# EAGLE schematic TestBoard (EAGLE 9.6.2)
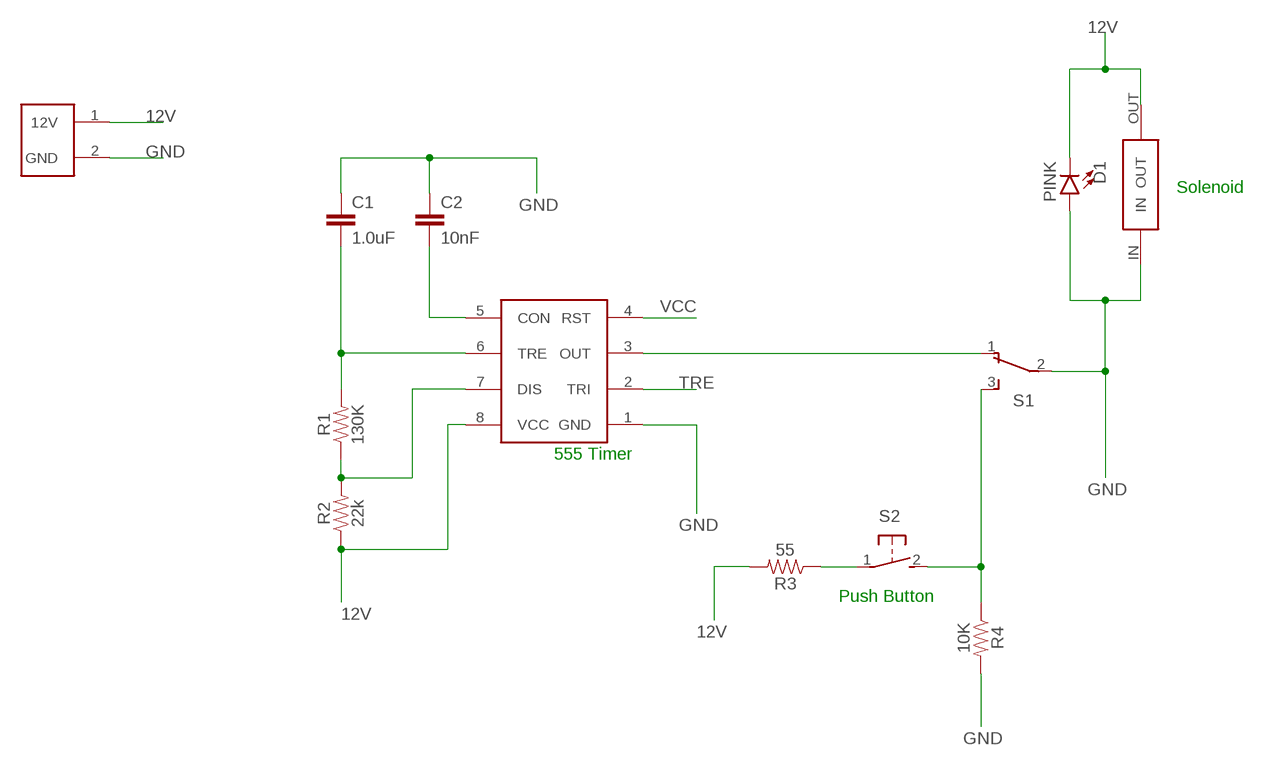
[diagram p0: schematic, sheet 1]

## Parts
C1  1.0uF  1.0UF-0402-16V-10%  [0402]
C2  10nF  10NF-0603-50V-10%  [0603]
D1  PINK  LED-PINK1206  [LED-1206]
R1  130K  0.22OHM-0805-1/4W-1%  [0805]
R2  22k  0.22OHM-0805-1/4W-1%  [0805]
R3  55  0.22OHM-0805-1/4W-1%  [0805]
R4  10K  0.22OHM-0805-1/4W-1%  [0805]
S1  TL36YO  [TL3XYO]
S2  31-XX  [B3F-31XX]
U$1  555TIMER  [555TIME]
U$2  BARRELJACK  [BARRELJACK]
U$3  SOLENOID  [SOL]

## Nets
12V: D1.C R2.1 R3.2 U$1.8(VCC) U$2.1(12V) U$3.OUT
GND: C1.1 C2.1 D1.A R4.2 S1.2(P) U$1.1(GND) U$2.2(GND) U$3.IN
N$1: R3.1 S2.1(P)
N$2: S1.1(O) U$1.3(OUT)
N$3: C1.2 R1.2 U$1.6(TRE)
N$4: C2.2 U$1.5(CON)
N$5: R4.1 S1.3(S) S2.2(S)
N$8: R1.1 R2.2 U$1.7(DIS)
TRE: U$1.2(TRI)
VCC: U$1.4(RST)

## Notes on the sheet
- Solenoid
- 555 Timer
- Push Button

## Library data of the parts
C1 = SparkFun-Capacitors:1.0UF: 1µF ceramic capacitors A capacitor is a passive two-terminal electrical component used to store electrical energy temporarily in an electric field.; PROD_ID: CAP-12417
C2 = SparkFun-Capacitors:10NF: 0.01uF/10nF/10,000pF ceramic capacitors A capacitor is a passive two-terminal electrical component used to store electrical energy temporarily in an electric field. CAP-09321; PROD_ID: CAP-00867
D1 = SparkFun-LED:LED-PINK: Pink SMD LED Used in manufacturing of various products at SparkFun Packages: 0603 - SMD 0603 package [Product Link] <http://cdn.sparkfun.com/datasheets/Components/General/S1206PKSBJC.pdf> SparkFun Products: LilyPad LED Pink <https://www.sparkfun.com/products/10962>; PROD_ID: DIO-10415
R1-R4 = SparkFun-Resistors:0.22OHM: 0.22Ω resistor A resistor is a passive two-terminal electrical component that implements electrical resistance as a circuit element. Resistors act to reduce current flow, and, at the same time, act to lower voltage levels within circuits. - Wikipedia; PROD_ID: RES-09883; VALUE: 0.22
S1 = switch:TL36YO: TINY SWITCH ON - ON Source: http://www2.produktinfo.conrad.com/datenblaetter/700000-724999/705152-da-01-de-Subminiaturschalter_TL_36YO.pdf
S2 = switch-omron:31-XX: OMRON SWITCH; MPN: B3F-3100; OC_FARNELL: 959704; OC_NEWARK: 36M3582
U$1 = SolTest:555TIMER
U$2 = SolTest:BARRELJACK
U$3 = SolTest:SOLENOID